# EAGLE design ColorfulTunes (EAGLE 9.5.1)
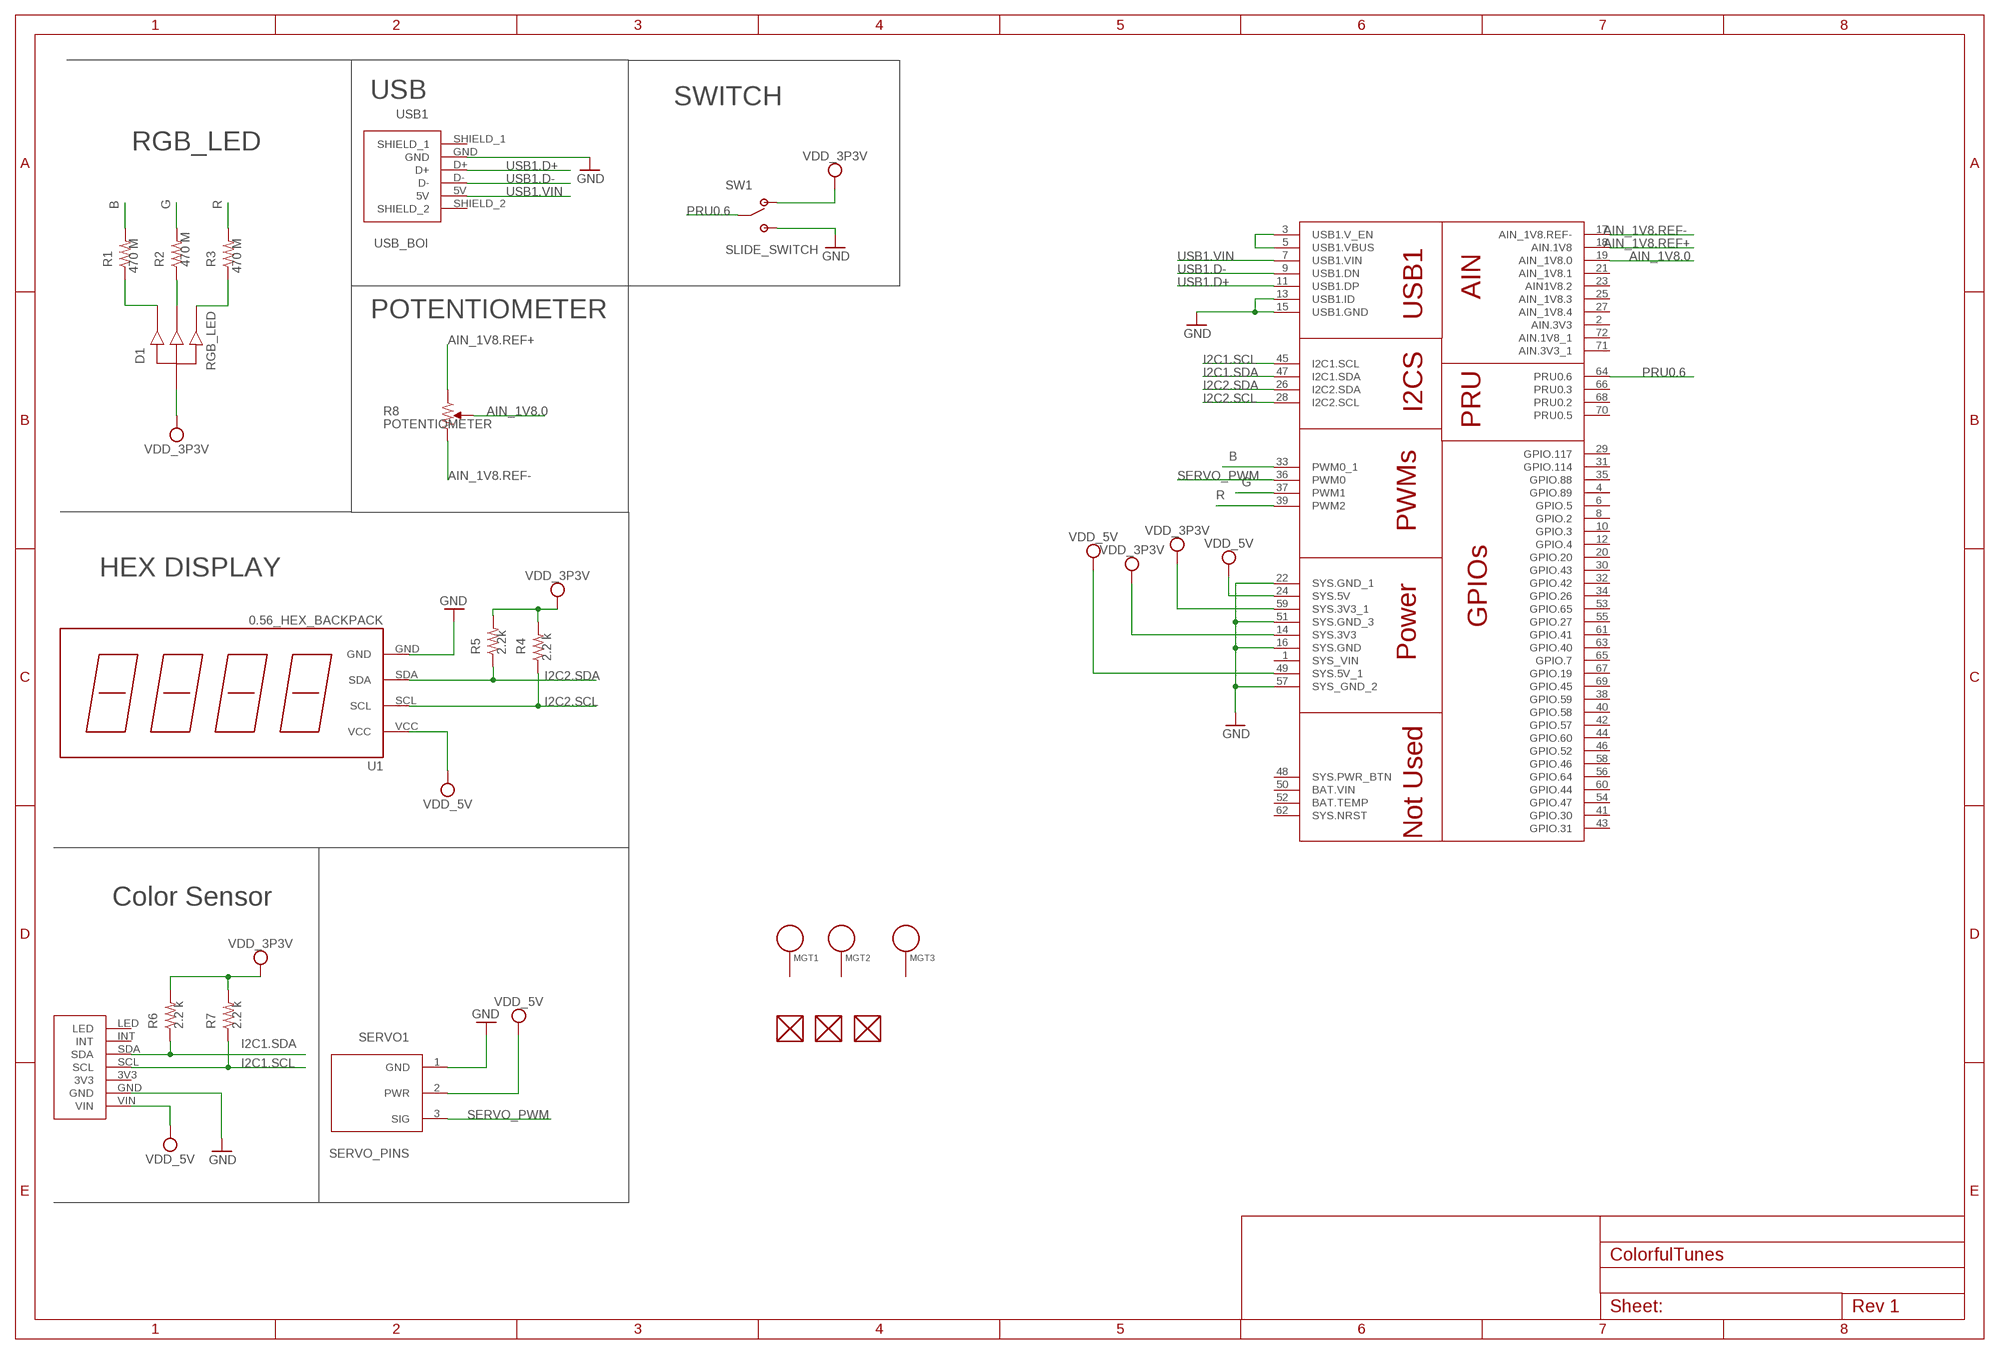
[diagram p0: schematic, sheet 1]

## Parts
CS1  COLOR_SENSOR_PINS  [COLOR_SENSOR]
D1  RGB_LED  [RGB_LED]
FUD1  FIDUCIAL  [FIDUCIAL_40MIL]
FUD2  FIDUCIAL  [FIDUCIAL_40MIL]
FUD3  FIDUCIAL  [FIDUCIAL_40MIL]
MGT1  MOUNTING_HOLE  [MOUNTING_HOLE]
MGT2  MOUNTING_HOLE  [MOUNTING_HOLE]
MGT3  MOUNTING_HOLE  [MOUNTING_HOLE]
R1  470 M  R_R0402  [R0402]
R2  470 M  R_R0402  [R0402]
R3  470 M  R_R0402  [R0402]
R4  2.2 k  R_R0402  [R0402]
R5  2.2k  R_R0402  [R0402]
R6  2.2 k  R_R0402  [R0402]
R7  2.2 k  R_R0402  [R0402]
R8  POTENTIOMETER  [POT-PO90S]
SERVO1  SERVO_PINS  [SERVO_PINS]
SW1  SLIDE_SWITCH  [JS202011SCQN]
U1  0.56_HEX_BACKPACK  [0.56_HEX_BACKPACK]
U$1  POCKET_BEAGLE  [POCKET_BEAGLE]
USB1  USB_BOI  [USB_BOI]

## Nets
AIN_1V8.0: R8.S U$1.19(AIN_1V8.0)
AIN_1V8.REF+: R8.CCW U$1.18(AIN.1V8)
AIN_1V8.REF-: R8.CW U$1.17(AIN_1V8.REF-)
B: R1.2 U$1.33(PWM0_1)
G: R2.2 U$1.37(PWM1)
GND: CS1.GND SERVO1.1(GND) SW1.3(POS2) SW1.6(POS2) U1.GND U$1.13(USB1.ID) U$1.15(USB1.GND) U$1.16(SYS.GND) U$1.22(SYS.GND_1) U$1.51(SYS.GND_3) U$1.57(SYS_GND_2) USB1.GND
I2C1.SCL: CS1.SCL R7.1 U$1.45(I2C1.SCL)
I2C1.SDA: CS1.SDA R6.1 U$1.47(I2C1.SDA)
I2C2.SCL: R4.1 U1.SCL U$1.28(I2C2.SCL)
I2C2.SDA: R5.1 U1.SDA U$1.26(I2C2.SDA)
N$1: D1.2(PWM1) R1.1
N$2: D1.3(PWM2) R2.1
N$3: D1.4(PWM3) R3.1
N$4: U$1.3(USB1.V_EN) U$1.5(USB1.VBUS)
PRU0.6: SW1.2(COMM) SW1.5(COMM) U$1.64(PRU0.6)
R: R3.2 U$1.39(PWM2)
SERVO_PWM: SERVO1.3(SIG) U$1.36(PWM0)
USB1.D+: U$1.11(USB1.DP) USB1.D+
USB1.D-: U$1.9(USB1.DN) USB1.D-
USB1.VIN: U$1.7(USB1.VIN) USB1.5V
VDD_3P3V: D1.1(PWR) R4.2 R5.2 R6.2 R7.2 SW1.1(POS1) SW1.4(POS1) U$1.14(SYS.3V3) U$1.59(SYS.3V3_1)
VDD_5V: CS1.VIN SERVO1.2(PWR) U1.VCC U$1.24(SYS.5V) U$1.49(SYS.5V_1)
Unconnected: CS1.3V3 CS1.INT CS1.LED FUD1.P$1 FUD2.P$1 FUD3.P$1 MGT1.P$1 MGT2.P$1 MGT3.P$1 U$1.2(AIN.3V3) U$1.4(GPIO.89) U$1.6(GPIO.5) U$1.8(GPIO.2) U$1.10(GPIO.3) U$1.12(GPIO.4) U$1.20(GPIO.20) U$1.21(AIN_1V8.1) U$1.23(AIN1V8.2) U$1.25(AIN_1V8.3) U$1.27(AIN_1V8.4) U$1.29(GPIO.117) U$1.30(GPIO.43) U$1.31(GPIO.114) U$1.32(GPIO.42) U$1.34(GPIO.26) U$1.35(GPIO.88) U$1.38(GPIO.59) U$1.40(GPIO.58) U$1.41(GPIO.30) U$1.42(GPIO.57) U$1.43(GPIO.31) U$1.44(GPIO.60) U$1.46(GPIO.52) U$1.48(SYS.PWR_BTN) U$1.50(BAT.VIN) U$1.52(BAT.TEMP) U$1.53(GPIO.65) U$1.54(GPIO.47) U$1.55(GPIO.27) U$1.56(GPIO.64) U$1.58(GPIO.46) U$1.60(GPIO.44) U$1.61(GPIO.41) U$1.62(SYS.NRST) U$1.63(GPIO.40) U$1.65(GPIO.7) U$1.66(PRU0.3) U$1.67(GPIO.19) U$1.68(PRU0.2) U$1.69(GPIO.45) U$1.70(PRU0.5) U$1.71(AIN.3V3_1) U$1.72(AIN.1V8_1) USB1.SHIELD_1 USB1.SHIELD_2

## Notes on the sheet
- USB | SWITCH
- RGB_LED
- POTENTIOMETER
- HEX DISPLAY
- Color Sensor

## Power pins joined to a net without a drawn wire
SYS_VIN: U$1.1(SYS_VIN)

## Library data of the parts
CS1 = ColorfulTunes:COLOR_SENSOR_PINS
D1 = ColorfulTunes:RGB_LED: RGB LED SMD PLCC-4
FUD1-FUD3 = ColorfulTunes:FIDUCIAL
MGT1-MGT3 = ColorfulTunes:MOUNTING_HOLE: Chassis Mounting Hole w/GND connection ability
R1-R7 = ColorfulTunes:R_: RESISTOR, American symbol
R8 = ColorfulTunes:POTENTIOMETER: Potentiometer - Examples: P090S-14T20BR10K (987-1277-ND)
SERVO1 = ColorfulTunes:SERVO_PINS
SW1 = ColorfulTunes:SLIDE_SWITCH: JS202011SCQN SPDT Slide Switch
U1 = ColorfulTunes:0.56_HEX_BACKPACK: 0.56" LED HEX Backback - Adafruit HT16K33 - https://www.adafruit.com/product/878 - https://www.adafruit.com/product/879 - https://www.adafruit.com/product/880 - https://www.adafruit.com/product/881 - https://www.adafruit.com/product/1002
U$1 = ColorfulTunes:POCKET_BEAGLE
USB1 = ColorfulTunes:USB_BOI

## Board
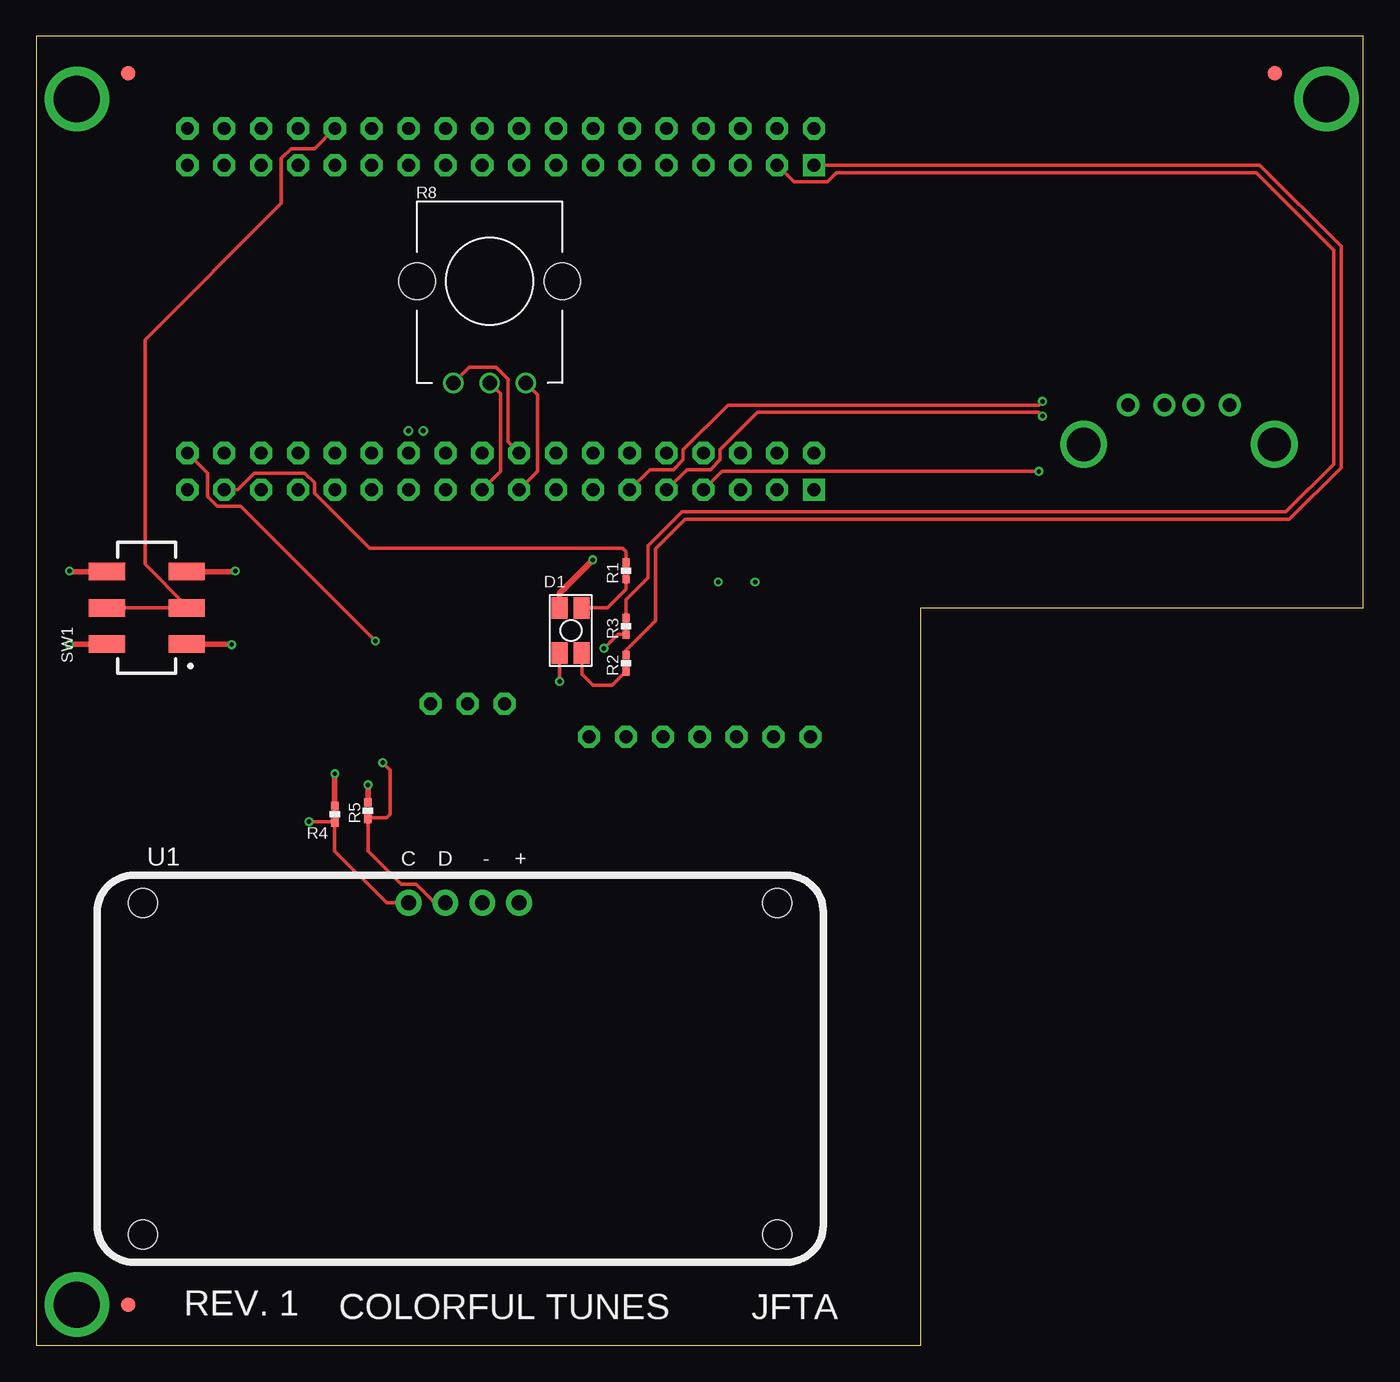
[diagram p1: board, top side]
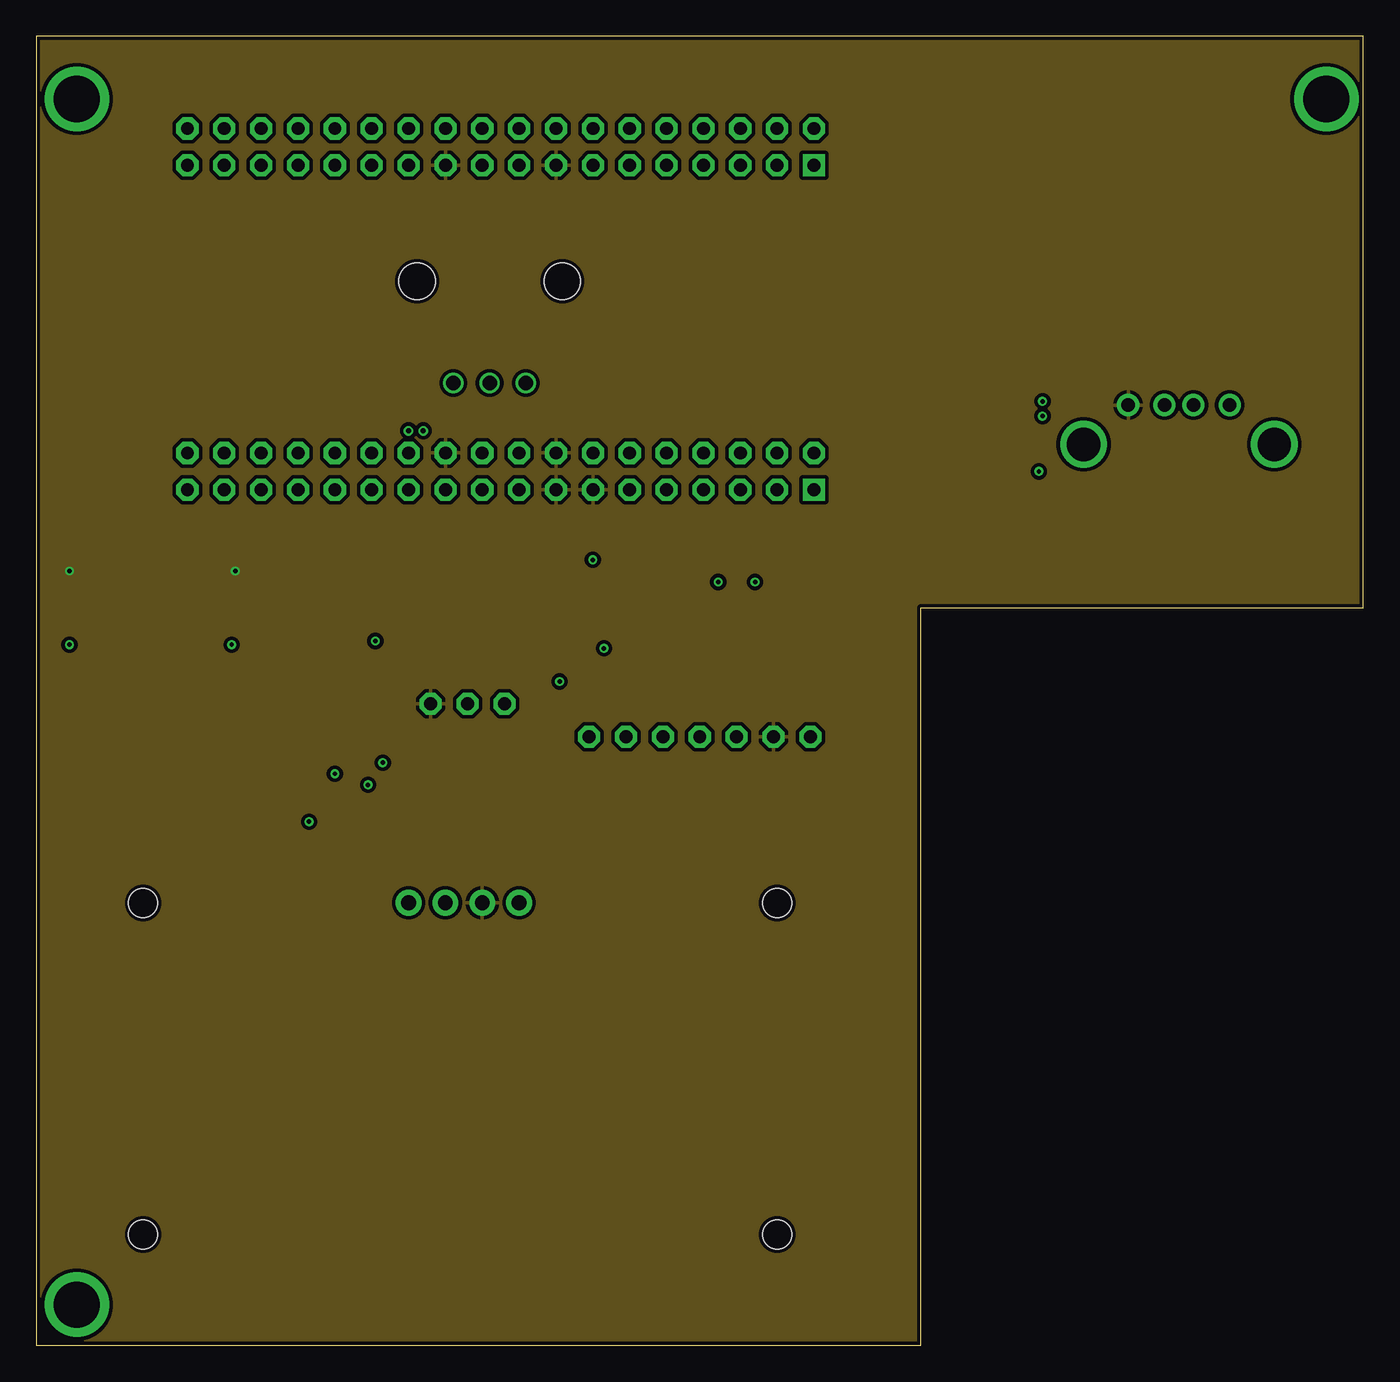
[diagram p2: board, inner layer Route2]
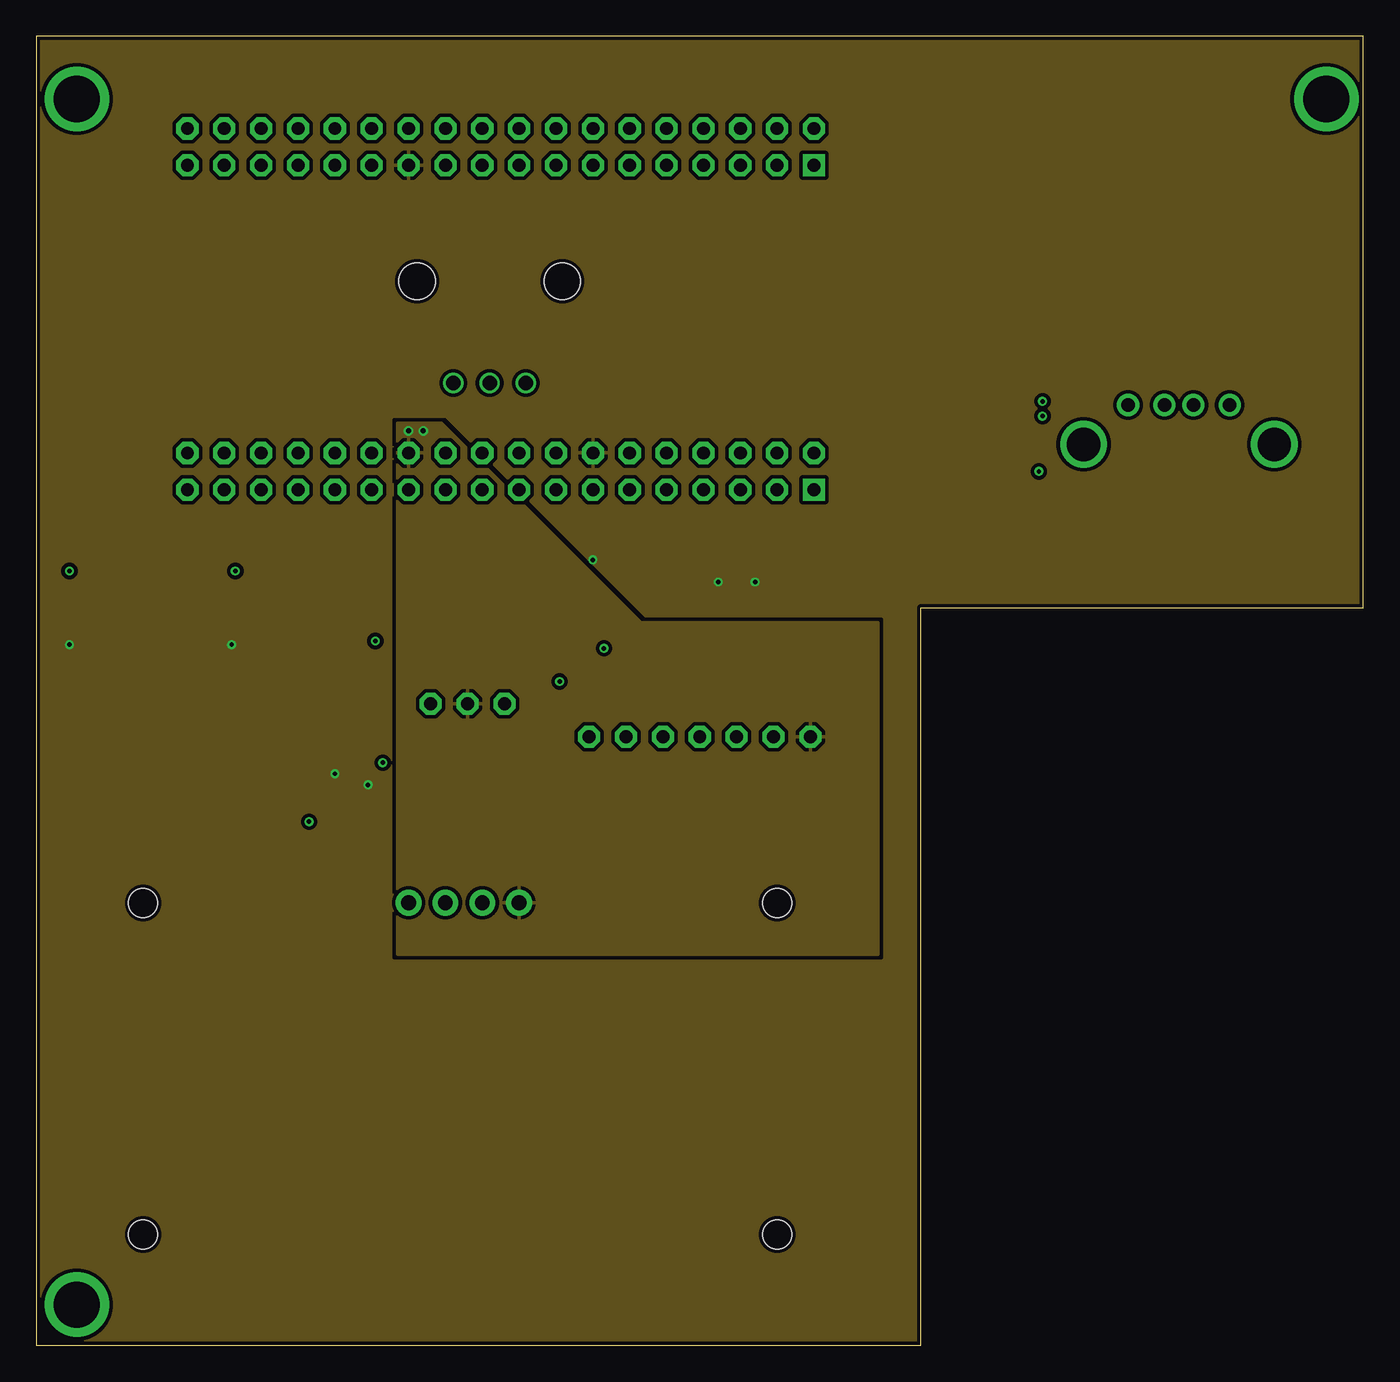
[diagram p3: board, inner layer Route15]
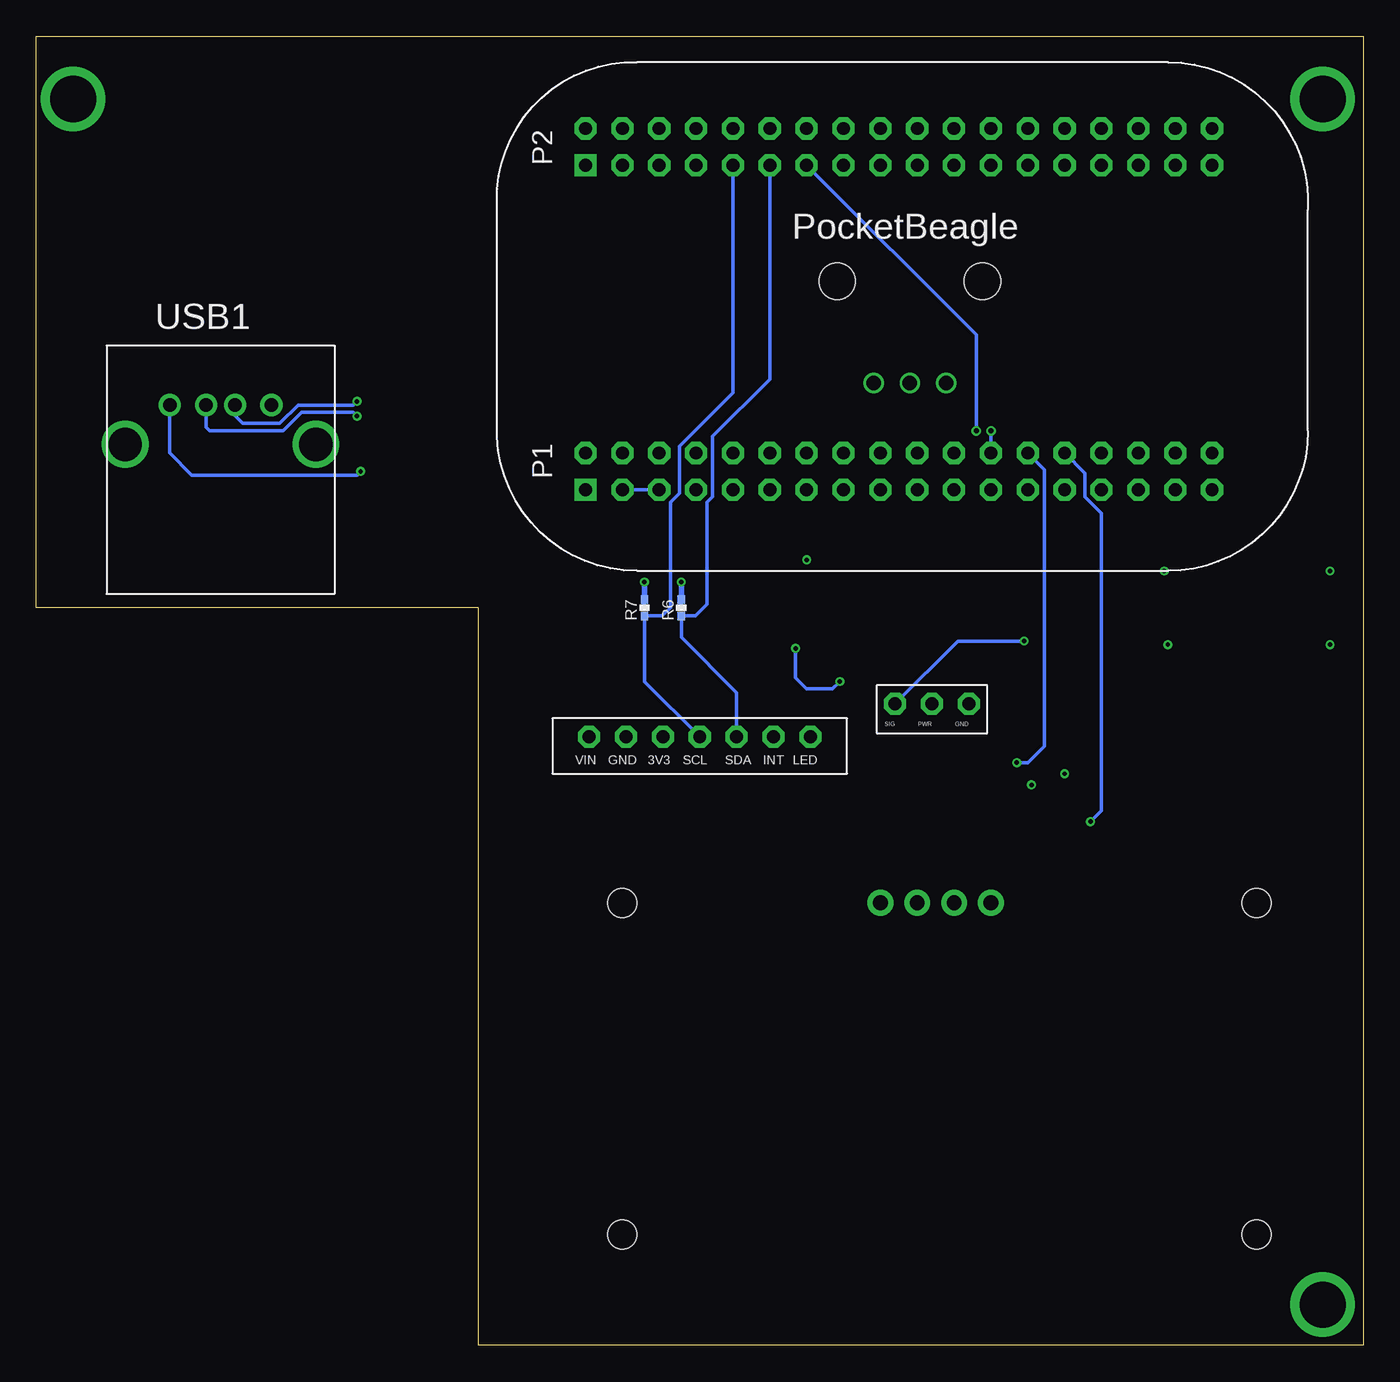
[diagram p4: board, bottom side, seen from below]

Size 91.44 x 90.17 mm. Coordinates in mm from the lower left corner, seen from the top.
Outline: 0,0 60.96,0 60.96,50.8 91.44,50.8 91.44,90.17 0,90.17 0,0
Copper layers (1*2*15*16): Top 0.035mm / dielectric 0.23mm / Route2 0.035mm / dielectric 0.93mm / Route15 0.035mm / dielectric 0.23mm / Bottom 0.035mm
Design rules "ENGI301_4lyr": minimum track width 10mil, minimum drill 12mil, track to track 10mil, track to pad 10mil, pad to pad 10mil, via to via 10mil, smd to smd 10mil, copper to edge 10mil, drill to drill 12mil, minimum pad ring 6mil, minimum via ring 6mil, stop-mask expansion 3mil, vias tented up to drill 25mil, thermal gap 10mil

### Footprints (pad centres in the part's own frame; a part is rotated, then mirrored left to right if it is on the bottom)
COLOR_SENSOR = drill 0.889 pad 1.524 octagon: 3V3 10.16,0; GND 12.7,0; INT 2.54,0; LED 0,0; SCL 7.62,0; SDA 5.08,0; VIN 15.24,0
RGB_LED = smd 1.1 x 1.5: 1 0.5,3.8; 2 2,3.8; 3 2,0.7; 4 0.5,0.7
FIDUCIAL_40MIL = smd 1.016 x 1.016: P$1 0,0
MOUNTING_HOLE = drill 3.175 pad 4.445: P$1 0,0
R0402 = smd 0.61 x 0.508: 1 -0.559,0; 2 0.559,0
POT-PO90S = drill 1: CCW -2.5,0; CW 2.5,0; S 0,0 | hole 2.5: -5,7; 5,7
SERVO_PINS = drill 0.889 pad 1.524 octagon: 1 -2.54,0; 2 0,0; 3 2.54,0
JS202011SCQN = smd 1.2 x 2.5: 1 -2.5,-2.75; 2 0,-2.75; 3 2.5,-2.75; 4 -2.5,2.75; 5 0,2.75; 6 2.5,2.75
0.56_HEX_BACKPACK = drill 1.016 pad 1.778: GND 1.524,11.43; SCL -3.556,11.43; SDA -1.016,11.43; VCC 4.064,11.43 | hole 2: -21.844,-11.43; 21.844,-11.43; -21.844,11.43; 21.844,11.43
POCKET_BEAGLE = drill 0.889 pad 1.524 square: 1 6.096,5.588; 37 6.096,27.94 | drill 0.889 pad 1.524 octagon: 2 6.096,8.128; 3 8.636,5.588; 4 8.636,8.128; 5 11.176,5.588; 6 11.176,8.128; 7 13.716,5.588; 8 13.716,8.128; 9 16.256,5.588; 10 16.256,8.128; 11 18.796,5.588; 12 18.796,8.128; 13 21.336,5.588; 14 21.336,8.128; 15 23.876,5.588; 16 23.876,8.128; 17 26.416,5.588; 18 26.416,8.128; 19 28.956,5.588; 20 28.956,8.128; 21 31.496,5.588; 22 31.496,8.128; 23 34.036,5.588; 24 34.036,8.128; 25 36.576,5.588; 26 36.576,8.128; 27 39.116,5.588; 28 39.116,8.128; 29 41.656,5.588; 30 41.656,8.128; 31 44.196,5.588; 32 44.196,8.128; 33 46.736,5.588; 34 46.736,8.128; 35 49.276,5.588; 36 49.276,8.128; 38 6.096,30.48; 39 8.636,27.94; 40 8.636,30.48; 41 11.176,27.94; 42 11.176,30.48; 43 13.716,27.94; 44 13.716,30.48; 45 16.256,27.94; 46 16.256,30.48; 47 18.796,27.94; 48 18.796,30.48; 49 21.336,27.94; 50 21.336,30.48; 51 23.876,27.94; 52 23.876,30.48; 53 26.416,27.94; 54 26.416,30.48; 55 28.956,27.94; 56 28.956,30.48; 57 31.496,27.94; 58 31.496,30.48; 59 34.036,27.94; 60 34.036,30.48; 61 36.576,27.94; 62 36.576,30.48; 63 39.116,27.94; 64 39.116,30.48; 65 41.656,27.94; 66 41.656,30.48; 67 44.196,27.94; 68 44.196,30.48; 69 46.736,27.94; 70 46.736,30.48; 71 49.276,27.94; 72 49.276,30.48
USB_BOI = drill 0.92 pad 1.524: 5V -3.5,0; D+ 1,0; D- -1,0; GND 3.5,0 | drill 2.3 pad 3: SHIELD_1 6.57,-2.71; SHIELD_2 -6.57,-2.71

### Placement (x,y rotation side)
CS1  38.1,41.91 180 bottom
D1  35.56,46.99 0 top
FUD1  6.35,2.79 0 top
FUD2  6.35,87.63 0 top
FUD3  85.34,87.63 0 top
MGT1  2.79,2.79 0 top
MGT2  2.79,85.85 0 top
MGT3  88.9,85.85 0 top
R1  40.64,53.34 90 top
R2  40.64,46.99 90 top
R3  40.64,49.53 90 top
R4  20.57,36.58 90 top
R5  22.86,36.83 90 top
R6  46.99,50.8 90 bottom
R7  49.53,50.8 90 bottom
R8  31.24,66.29 0 top
SERVO1  29.72,44.2 180 bottom
SW1  7.62,50.8 90 top
U1  29.21,19.05 0 top
U$1  59.69,53.34 0 bottom
USB1  78.74,64.77 0 bottom

### Tracks (layer width: path | path; a pad name or v marks a point on that pad's centre or on a via)
AIN_1V8.0
  Top 0.254: U$1.19 32,60.2 32,65.53 R8.S
AIN_1V8.REF+
  Top 0.254: U$1.18 32.51,62.23 32.51,66.55 31.69,67.38 29.82,67.38 R8.CCW
AIN_1V8.REF-
  Top 0.254: U$1.17 34.54,60.2 34.54,65.49 R8.CW
B
  Top 0.254: R1.2 40.64,54.66 40.39,54.91 22.97,54.91 19.18,58.71 19.18,59.4 18.51,60.07 15.02,60.07 13.88,58.93 U$1.33
G
  Top 0.254: R2.2 40.64,47.87 42.67,49.91 42.67,54.86 44.7,56.9 86.36,56.9 89.92,60.45 89.92,75.69 84.33,81.28 U$1.37
GND  (via drill 0.3 pad 0.61)
  Top 0.254: 13.68,53.3 v13.72,53.34 | 2.33,53.3 v2.29,53.34
  Top 0.381: SW1.3 13.68,53.3 | SW1.6 2.33,53.3
  pour Route2: -2.54,92.71 -2.54,-2.54 93.98,-2.54 93.98,92.71
I2C1.SCL
  Bottom 0.254: U$1.45 43.43,65.62 47.12,61.94 47.12,58.71 47.75,58.07 47.75,50.8 48.31,50.24 R7.1 49.53,45.72 CS1.SCL
I2C1.SDA
  Bottom 0.254: U$1.47 40.89,66.55 44.83,62.61 44.83,58.45 45.21,58.07 45.21,51.05 46.02,50.24 R6.1 46.99,48.77 43.18,44.96 CS1.SDA
I2C2.SCL  (via drill 0.3 pad 0.61)
  Top 0.254: U1.SCL 24.13,30.48 20.57,34.04 R4.1 20.52,36.07 v18.8,36.07
  Bottom 0.254: v18.8,36.07 18.03,36.83 18.03,57.31 19.18,58.45 19.18,60.07 U$1.28
I2C2.SDA  (via drill 0.3 pad 0.61)
  Top 0.254: U1.SDA 27.45,30.48 26.18,31.75 25.15,31.75 22.86,34.04 R5.1 22.91,36.32 24.13,36.32 24.38,36.58 24.38,39.62 v23.88,40.13
  Bottom 0.254: v23.88,40.13 23.11,40.13 21.97,41.27 21.97,60.33 U$1.26
N$1
  Top 0.254: D1.2 39.37,50.8 40.64,52.07 R1.1
N$2
  Top 0.254: D1.3 37.59,47.66 37.59,46.23 38.35,45.47 39.67,45.47 R2.1
N$3  (via drill 0.3 pad 0.61)
  Top 0.254: D1.4 v36.07,45.72 | v39.12,48.01 40.08,48.97 R3.1
  Bottom 0.254: v36.07,45.72 36.58,45.21 38.35,45.21 39.12,45.97 v39.12,48.01
N$4
  Bottom 0.254: U$1.5 U$1.3
PRU0.6
  Top 0.254: U$1.64 19.18,82.42 17.56,82.42 16.89,81.75 16.89,78.65 7.49,69.26 7.49,53.79 10.37,50.91 SW1.2 SW1.5
R
  Top 0.254: R3.2 40.64,51.35 42.16,52.88 42.16,55.07 44.49,57.4 86.11,57.4 89.41,60.71 89.41,75.44 84.07,80.77 55.15,80.77 54.51,80.14 52.2,80.14 U$1.39
SERVO_PWM  (via drill 0.3 pad 0.61)
  Top 0.254: v23.37,48.51 14.1,57.78 12.48,57.78 11.81,58.45 11.81,60.07 U$1.36
  Bottom 0.254: SERVO1.3 27.94,48.51 v23.37,48.51
USB1.D+  (via drill 0.3 pad 0.61)
  Top 0.254: U$1.11 42.29,60.33 43.91,60.33 44.58,60.99 44.58,61.69 47.66,64.77 69.09,64.77 v69.34,65.02
  Bottom 0.254: USB1.D+ 77.74,64.02 77.22,63.5 74.68,63.5 73.41,64.77 69.6,64.77 v69.34,65.02
USB1.D-  (via drill 0.3 pad 0.61)
  Top 0.254: U$1.9 44.83,60.33 46.45,60.33 47.12,60.99 47.12,61.69 49.69,64.26 69.09,64.26 v69.34,64.01
  Bottom 0.254: v69.34,64.01 69.6,64.26 73.15,64.26 74.42,62.99 79.5,62.99 79.74,63.23 USB1.D-
USB1.VIN  (via drill 0.3 pad 0.61)
  Top 0.254: U$1.7 47.24,60.2 v69.09,60.2
  Bottom 0.254: USB1.5V 82.24,61.47 80.72,59.94 69.34,59.94 v69.09,60.2
VDD_3P3V  (via drill 0.3 pad 0.61)
  Top 0.254: 13.42,48.3 v13.46,48.26 | 2.33,48.3 v2.29,48.26
  Top 0.381: R5.2 v22.86,38.61 | SW1.1 13.42,48.3 | R4.2 v20.57,39.37 | D1.1 36.06,51.81 v38.35,54.1 | SW1.4 2.33,48.3
  Bottom 0.381: R6.2 v46.99,52.58 | R7.2 v49.53,52.58
  pour Route15 (rank 6): -5.08,95.25 -5.08,-7.62 97.03,-7.62 97.03,95.25
VDD_5V  (via drill 0.35)
  Bottom 0.254: U$1.24 v25.65,62.99 | v26.67,62.99 26.67,69.6 U$1.49
  pour Route15: 24.89,63.5 24.89,26.92 57.99,26.92 57.99,49.78 41.66,49.78 27.94,63.5

### Text on the board
tNames: REV. 1 | COLORFUL TUNES | JFTA